# EAGLE design EEGAmp_SMT_MountHole_Castellated (EAGLE 9.6.2)
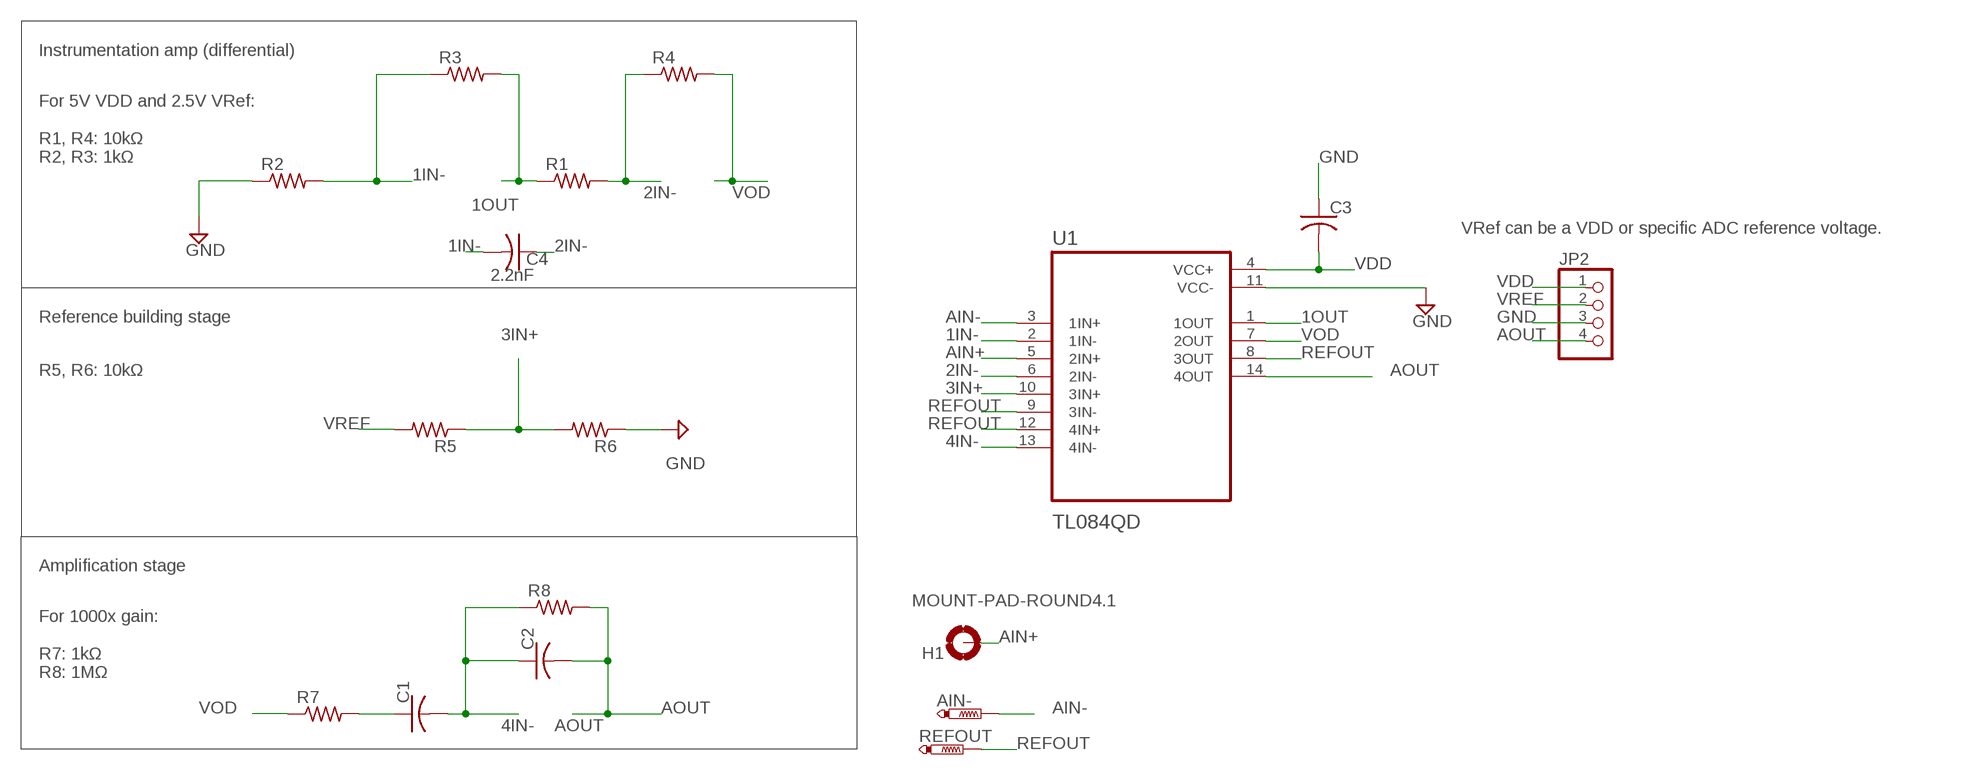
[diagram p0: schematic, sheet 1]

## Parts
AIN-  PTR1PAD1-17  [P1-17]
C1  C-USC0402  [C0402]
C2  C-USC0402  [C0402]
C3  C-USC0402  [C0402]
C4  2.2nF  C-USC0402  [C0402]
H1  MOUNT-PAD-ROUND4.1  [4,1-PAD]
JP2  PINHD-1X4  [1X04]
R1  R-US_R0402  [R0402]
R2  R-US_R0402  [R0402]
R3  R-US_R0402  [R0402]
R4  R-US_R0402  [R0402]
R5  R-US_R0402  [R0402]
R6  R-US_R0402  [R0402]
R7  R-US_R0402  [R0402]
R8  R-US_R0402  [R0402]
REFOUT  PTR1PAD1-17  [P1-17]
U1  TL084QD  [SOIC127P600X175-14N]

## Nets
1IN-: C4.2 R2.2 R3.1 U1.2(1IN-)
1OUT: R1.1 R3.2 U1.1(1OUT)
2IN-: C4.1 R1.2 R4.1 U1.6(2IN-)
3IN+: R5.1 R6.2 U1.10(3IN+)
4IN-: C1.2 C2.1 R8.1 U1.13(4IN-)
AIN+: H1.B4,1(MOUNT) U1.5(2IN+)
AIN-: AIN-.TP U1.3(1IN+)
AOUT: C2.2 JP2.4 R8.2 U1.14(4OUT)
GND: C3.1 JP2.3 R2.1 R6.1 U1.11(VCC-)
N$9: C1.1 R7.2
REFOUT: REFOUT.TP U1.8(3OUT) U1.9(3IN-) U1.12(4IN+)
VDD: C3.2 JP2.1 U1.4(VCC+)
VOD: R4.2 R7.1 U1.7(2OUT)
VREF: JP2.2 R5.2

## Notes on the sheet
- Instrumentation amp (differential)
- For 5V VDD and 2.5V VRef:
  
  R1, R4: 10kΩ
  R2, R3: 1kΩ
- VRef can be a VDD or specific ADC reference voltage.
- Reference building stage
- R5, R6: 10kΩ
- Amplification stage
- For 1000x gain:
  
  R7: 1kΩ
  R8: 1MΩ

## Library data of the parts
AIN- REFOUT = testpad:PTR1: TEST PIN
C1-C4 = rcl:C-US: CAPACITOR, American symbol; SPICEPREFIX: C
H1 = holes:MOUNT-PAD-ROUND: MOUNTING PAD, round
JP2 = pinhead:PINHD-1X4: PIN HEADER
R1-R8 = rcl:R-US_: RESISTOR, American symbol; SPICEPREFIX: R
U1 = TL084QD:TL084QD: Check availability <https://pricing.snapeda.com/parts/TL084QD/Texas%20Instruments/view-part?ref=eda>; AVAILABILITY: In Stock; CHECK_PRICES: https://www.snapeda.com/parts/TL084QD/Texas+Instruments/view-part/?ref=eda; DESCRIPTION: Quad, 30-V, 3-MHz, 13-V/µs slew rate, In to V+, JFET-input op amp; MF: Texas Instruments; MP: TL084QD; PACKAGE: SOIC-14 Texas Instruments; PRICE: None; PURCHASE-URL: https://www.snapeda.com/api/url_track_click_mouser/?unipart_id=1136083&manufacturer=Texas Instruments&part_name=TL084QD&search_term=tl084; SNAPEDA_LINK: https://www.snapeda.com/parts/TL084QD/Texas+Instruments/view-part/?ref=snap

## Board
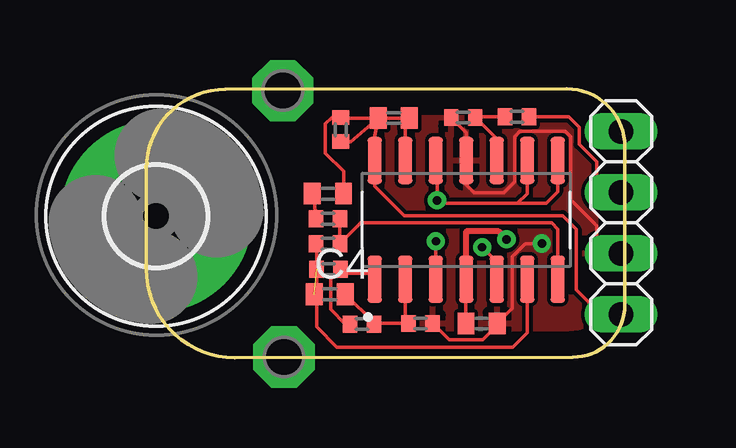
[diagram p1: board, top side]
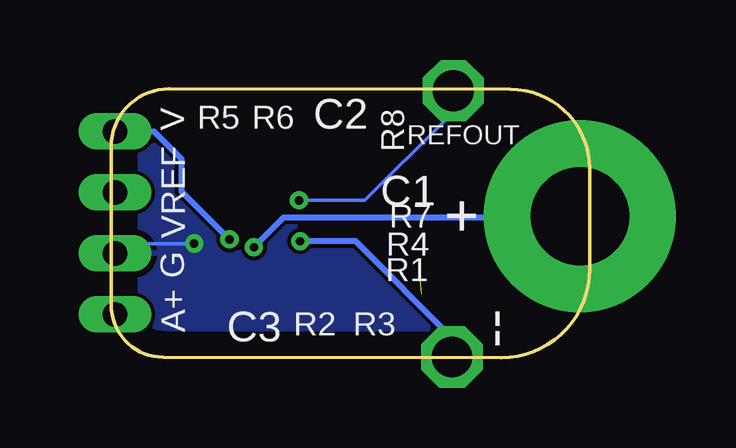
[diagram p2: board, bottom side, seen from below]

Size 19.94 x 11.2 mm. Coordinates in mm from the lower left corner, seen from the top.
Outline: 0,7.87 arc-90 3.3,11.18 17.53,11.2 arc-90 19.94,8.79 19.94,2.18 arc-90 17.78,0.03 3.68,0 arc-90 0,3.68 0,7.87
Copper layers (1*16): Top 0.035mm / dielectric 1.5mm / Bottom 0.035mm
Design rules "default": minimum track width 6mil, minimum drill 0.35mm, track to track 6mil, track to pad 6mil, pad to pad 6mil, via to via 6mil, smd to smd 6mil, copper to edge 40mil, drill to drill 6mil, minimum pad ring 10mil, minimum via ring 8mil, stop-mask expansion 4mil, vias tented up to drill 0mil, thermal gap 10mil

### Footprints (pad centres in the part's own frame; a part is rotated, then mirrored left to right if it is on the bottom)
P1-17 = drill 1.702 pad 2.54 octagon: TP 0,0
C0402 = smd 0.7 x 0.9: 1 -0.65,0; 2 0.65,0
4,1-PAD = drill 4.1 pad 8: B4,1 0,0
1X04 = drill 1.016 long: 1 -3.81,0; 2 -1.27,0; 3 1.27,0; 4 3.81,0
R0402 = smd 0.6 x 0.7: 1 -0.5,0; 2 0.5,0
SOIC127P600X175-14N = smd 1.97 x 0.6: 1 -2.475,3.81; 2 -2.475,2.54; 3 -2.475,1.27; 4 -2.475,0; 5 -2.475,-1.27; 6 -2.475,-2.54; 7 -2.475,-3.81; 8 2.475,-3.81; 9 2.475,-2.54; 10 2.475,-1.27; 11 2.475,0; 12 2.475,1.27; 13 2.475,2.54; 14 2.475,3.81

### Placement (x,y rotation side)
AIN-  5.74,0.03 90 top
C1  7.57,6.83 0 top
C2  10.31,9.98 180 top
C3  13.97,1.42 180 top
C4  7.65,2.64 0 top
H1  0.41,5.89 0 top
JP2  19.79,5.61 270 top
R1  7.59,3.68 180 top
R2  11.43,1.42 180 top
R3  8.99,1.4 180 top
R4  7.57,4.75 0 top
R5  15.44,10.03 0 top
R6  13.21,10.01 0 top
R7  7.57,5.79 180 top
R8  8.1,9.5 270 top
REFOUT  5.69,11.13 0 top
U1  13.34,5.74 90 top

### Tracks (layer width: path | path; a pad name or v marks a point on that pad's centre or on a via)
1IN-
  Top 0.152: U1.2 10.79,1.56 R2.2 9.49,1.42 | R3.1 9.49,1.42 | C4.2 9.49,1.45 9.49,1.42
1OUT
  Top 0.152: U1.1 9.27,3.52 8.26,3.52 R1.1 7.68,3.27 7.68,2.01 8.29,1.4 R3.2
2IN-  (1 unrouted)
  Top 0.152: U1.6 15.88,1.04 15.27,0.44 7.93,0.44 7.09,1.28 R1.2 7.09,4.72 R4.1
3IN+
  Top 0.152: R5.1 13.73,10.03 R6.2 14.61,9.11 U1.10
4IN-
  Top 0.152: U1.13 10.79,9.93 C2.1 8.12,9.98 R8.1 7.72,10 7.47,9.75 7.47,8.52 8.22,7.77 C1.2
AIN+  (via drill 0.35)
  Top 0.152: v13.99,4.6 14.61,3.99 U1.5
  Bottom 0.152: 0.46,5.84 H1.B4,1
  Bottom 0.254: v13.99,4.6 12.75,5.84 0.46,5.84
AIN-  (via drill 0.35)
  Top 0.152: v12.06,4.85 U1.3
  Bottom 0.254: AIN-.TP 5.74,0.84 9.75,4.85 v12.06,4.85
AOUT
  Top 0.152: R8.2 8.52,9 C2.2 9.36,8.39 U1.14 9.52,7.14 10.74,5.92 17.35,5.92 17.91,5.36 17.91,2.82 18.92,1.8 JP2.4
GND  (via drill 0.35)
  Top 0.152: R2.1 12.62,0.74 14.02,0.74 14.62,1.35 C3.1 15.25,2.06 15.25,4.21 15.8,4.75 v16.48,4.75 | R6.1 13.34,9.37 U1.11 13.34,7.2 13.66,6.87 14.89,6.87 15.35,7.33 15.35,9.21 15.57,9.43 17.45,9.43 17.68,9.2 17.68,6.58 18.77,5.49 18.77,4.72 19.15,4.34 JP2.3
  Bottom 0.152: v16.48,4.75 19.38,4.75 JP2.3
  pour Bottom: 19.99,11.18 19.99,0 0.03,0 0.03,11.18
  pour Top: 0.03,11.2 19.99,11.2 19.99,0 0.03,0
N$9
  Top 0.152: R7.2 7.07,6.15 7.02,6.2 7.02,6.73 C1.1
REFOUT  (via drill 0.35)
  Top 0.152: U1.8 17.14,6.91 16.66,6.43 15.47,6.43 | 15.47,6.43 12.24,6.43 v12.12,6.55 12.12,8.16 U1.12 | U1.9 15.88,6.83 15.47,6.43
  Bottom 0.152: v12.12,6.55 9.37,6.55 6.04,9.88 6.04,10.77 REFOUT.TP
VDD  (via drill 0.35)
  Top 0.152: C3.2 13.32,3.25 U1.4 13.36,3.29
  Top 0.254: U1.4 13.34,5.26 14.68,5.26 v15.01,4.93
  Bottom 0.254: JP2.1 18.16,9.42 17.02,8.28 17.02,6.93 v15.01,4.93
VOD
  Top 0.152: R7.1 R4.2 8.93,5.61 16.89,5.61 17.14,5.36 U1.7
VREF
  Top 0.152: R5.2 17.6,10.03 18.03,9.6 18.03,8.89 18.77,8.15 18.77,7.32 | 18.77,7.32 18.77,6.88 | JP2.2 19.2,6.88 18.77,7.32

### Text on the board
bNames: V | + | VREF | G | -- | A+